# Altium schematic sheet Leds.SchDoc: RGB LEDs
size A4; Organization: Use Organization_Name in ProjParam; Address1: Eliot Ferragni; Address2: STI-MOBOTS; Address3: EPFL; Address4: CH-1015 LAUSANNE; DocumentNumber: 2; Revision: A; SheetNumber: 2; SheetTotal: 7; ApprovedBy: Init ApprovedBy in DocParam; CheckedBy: Init CheckedBy in DocParam; Author: Init Author in DocParam; CompanyName: Init CompanyName in DocParam; DrawnBy: Init DrawBy in DocParam; Engineer: Init Engineer in DocParam; DocumentName: Init DocumentName in DocParam; ProjectName: Init ProjectName in DocParam
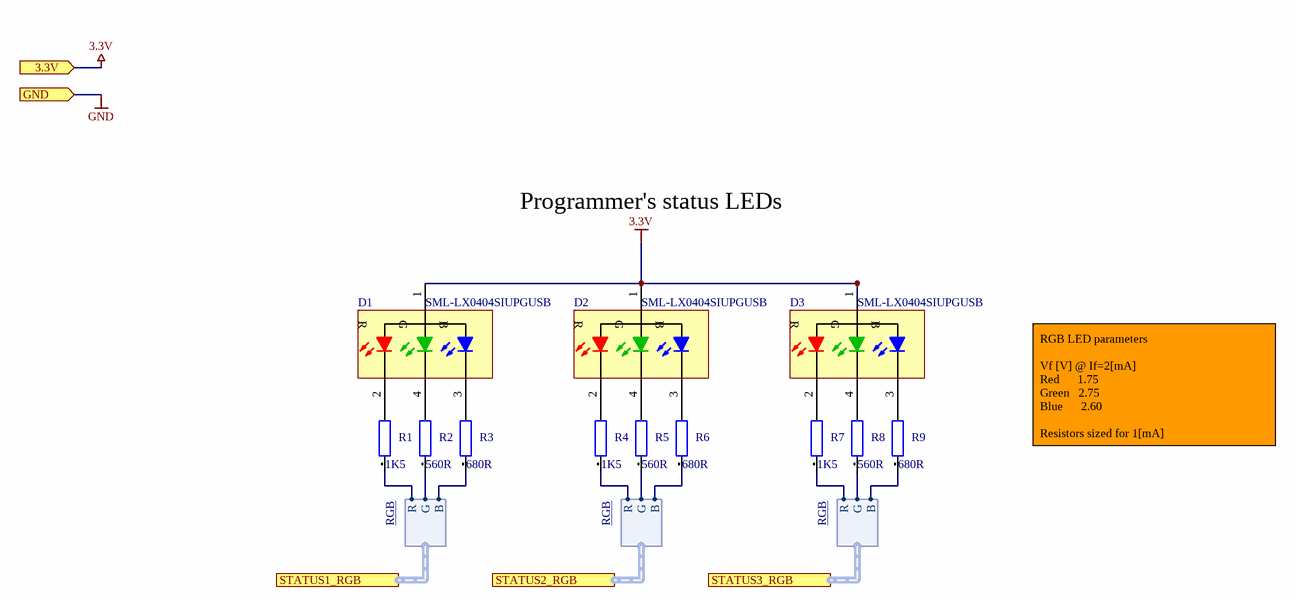
[diagram p0: Leds.SchDoc]

## Parts
D1  SML-LX0404SIUPGUSB  [LUMEX_SML-LX0404SIUPGUSB]
D2  SML-LX0404SIUPGUSB  [LUMEX_SML-LX0404SIUPGUSB]
D3  SML-LX0404SIUPGUSB  [LUMEX_SML-LX0404SIUPGUSB]
R1  1K5  [RESC1608X06N]
R2  560R  [RESC1608X06N]
R3  680R  [RESC1608X06N]
R4  1K5  [RESC1608X06N]
R5  560R  [RESC1608X06N]
R6  680R  [RESC1608X06N]
R7  1K5  [RESC1608X06N]
R8  560R  [RESC1608X06N]
R9  680R  [RESC1608X06N]

## Ports
3.3V (in), GND (in), STATUS1_RGB (harness RGB), STATUS2_RGB (harness RGB), STATUS3_RGB (harness RGB)

## Harnesses
RGB: R, G, B

## Nets
3.3V: D1.1(AC) D2.1(AC) D3.1(AC) ; port 3.3V
GND: port GND
NetD1_2: D1.2(RC) R1.2
NetD1_3: D1.3(BC) R3.2
NetD1_4: D1.4(GC) R2.2
NetD2_2: D2.2(RC) R4.2
NetD2_3: D2.3(BC) R6.2
NetD2_4: D2.4(GC) R5.2
NetD3_2: D3.2(RC) R7.2
NetD3_3: D3.3(BC) R9.2
NetD3_4: D3.4(GC) R8.2
NetR1_1: R1.1 ; port STATUS1_RGB.R
NetR2_1: R2.1 ; port STATUS1_RGB.G
NetR3_1: R3.1 ; port STATUS1_RGB.B
NetR4_1: R4.1 ; port STATUS2_RGB.R
NetR5_1: R5.1 ; port STATUS2_RGB.G
NetR6_1: R6.1 ; port STATUS2_RGB.B
NetR7_1: R7.1 ; port STATUS3_RGB.R
NetR8_1: R8.1 ; port STATUS3_RGB.G
NetR9_1: R9.1 ; port STATUS3_RGB.B

## Notes on the sheet
- Programmer's status LEDs
- RGB LED parameters
  Vf [V] @ If=2[mA]
  Red      1.75
  Green   2.75
  Blue      2.60
  Resistors sized for 1[mA]
- Date:
- Project
- Part
- Revision:
- File :
- Page
- de
- (in symbol LED-RGB-C243-A1) R; G; B

## Library data of the parts
D1-D3 = LED-RGB-C243-A1: QuasarBrite LED RGB (Full color 0404 SMD LED), 3x 2mA; Manufacturer: Lumex; Preference: 1; Currentie: CHF; Size: 0404; Footprint Acort: ToDefine; ComponentLink1URL: http://www.lumex.com/en/products/detail/leds7/surface_mount4/0404_package/; ComponentLink1Description: Manufacturer link; Supplier 1: Mouser; Supplier Part Number 1: 696-LX0404SIUPGUSB; ComponentLink2Description: Supplier link; ComponentLink2URL: http://www.mouser.ch/ProductDetail/Lumex/SML-LX0404SIUPGUSB/?qs=%2fha2pyFaduhVJD5ZRhDg%2ft7CXH9HmwqzW0VFa3tCuDCfVLKu7L8ofw8YssAqq7i9; Manufacturer Nr: SML-LX0404SIUPGUSB; ROHS: True; DateLastUpdate: 2015-06-26 / 09:49:20
R1-R9 = TBD[[/\]]0603[[/\]]1: Resistor ToDo 0603; Preference: 1; Currentie: CHF; Size: 0603; Footprint Acort: 0603; ROHS: True; DateLastUpdate: 2012-11-19 / 14:13:33